# EAGLE design Loco-Universal (EAGLE 9.7.0)

## Sheet 1 of 2
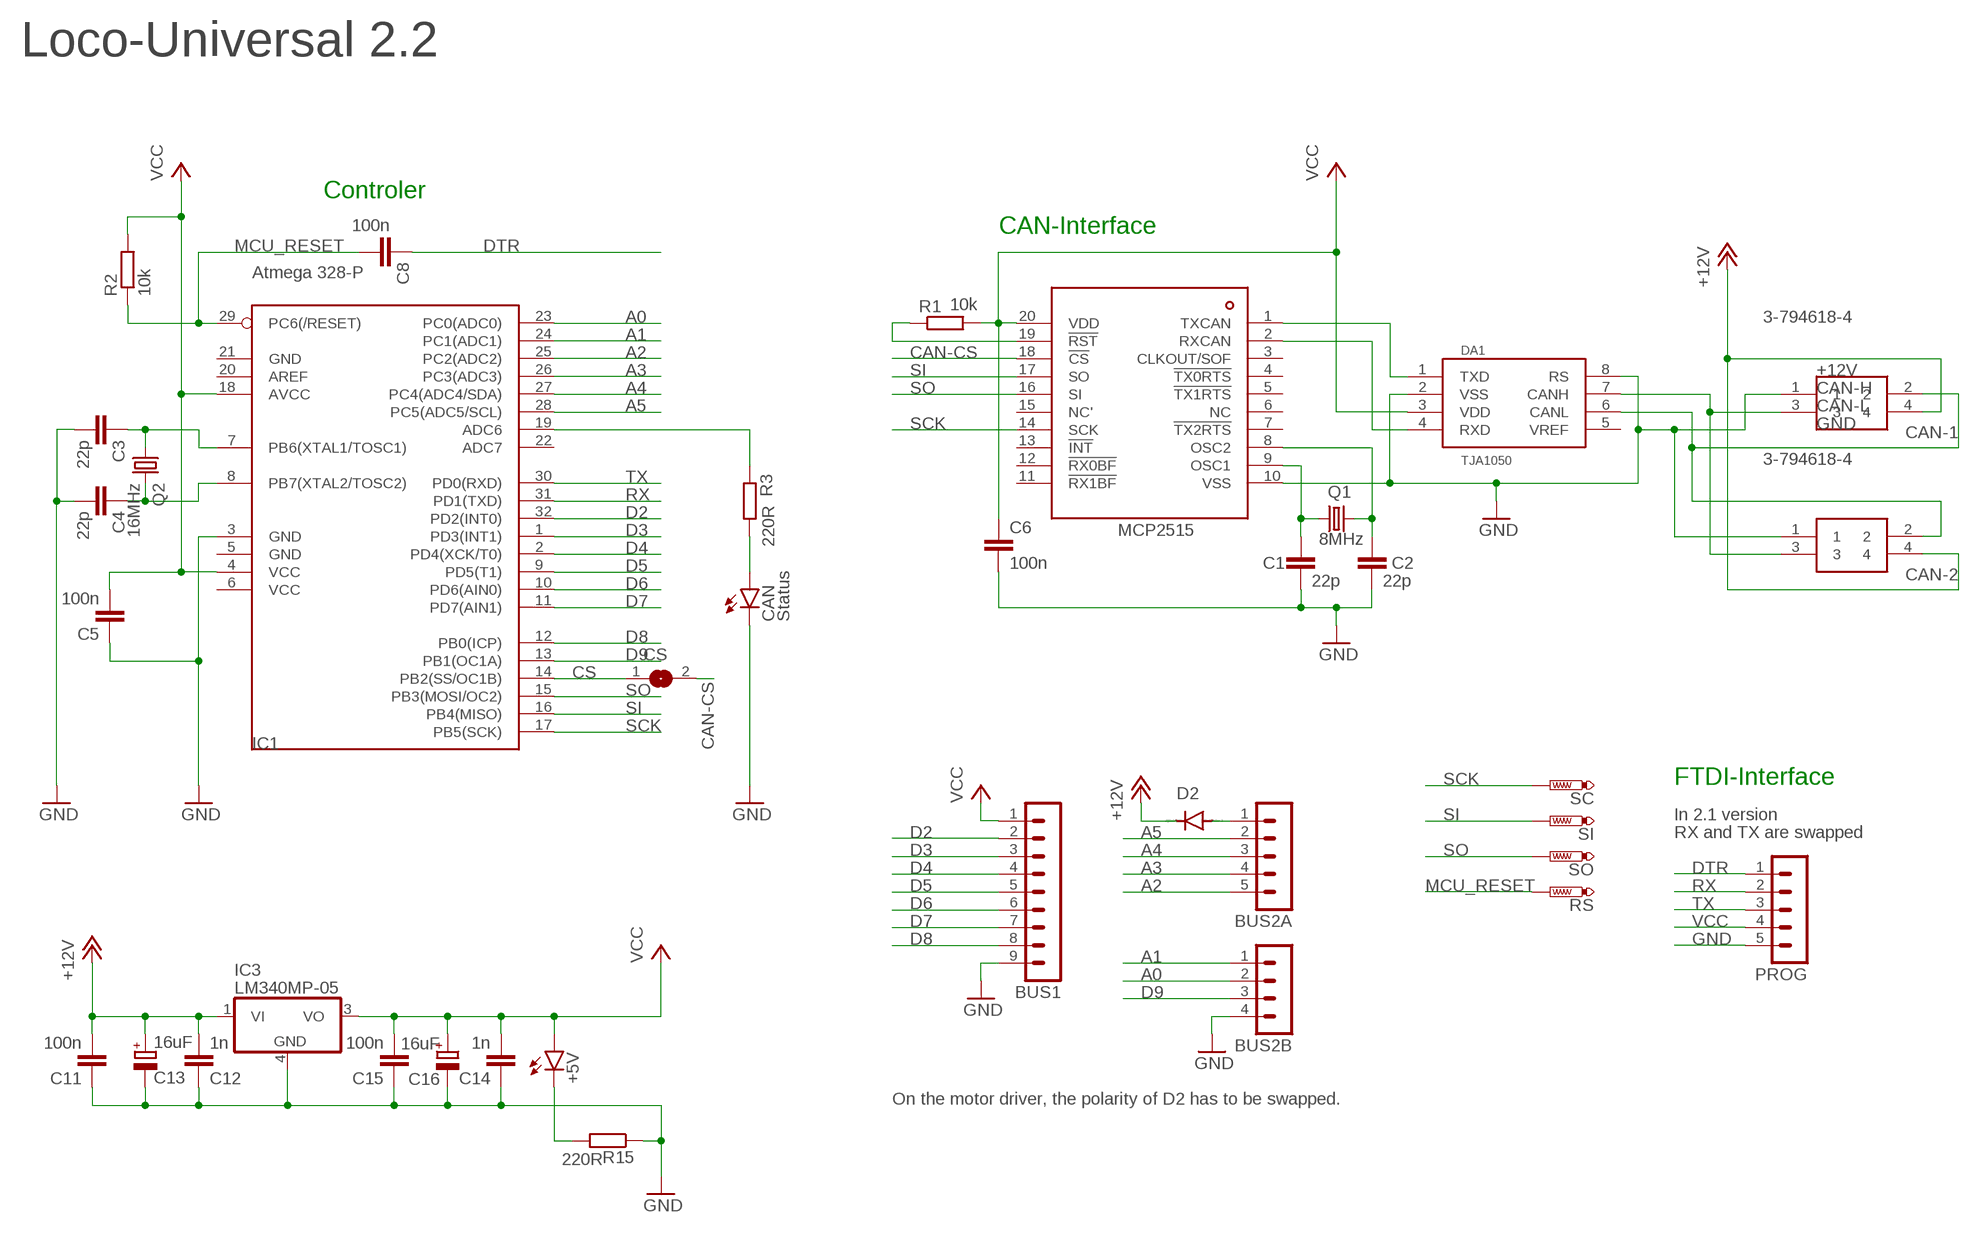
[diagram p0: schematic, sheet 1]

### Parts
+5V  LEDCHIP-LED0603  [CHIP-LED0603]
BUS1  MA09-1  [MA09-1]
BUS2A  MA05-1  [MA05-1]
BUS2B  MA04-1  [MA04-1]
C1  22p  C-EUC0402K  [C0402K]
C2  22p  C-EUC0402K  [C0402K]
C3  22p  C-EUC0402K  [C0402K]
C4  22p  C-EUC0402K  [C0402K]
C5  100n  C-EUC0402K  [C0402K]
C6  100n  C-EUC0402K  [C0402K]
C8  100n  C-EUC0402K  [C0402K]
C11  100n  C-EUC0402K  [C0402K]
C12  1n  C-EUC0402K  [C0402K]
C13  16uF  CPOL-EUA/3216-18W  [A/3216-18W]
C14  1n  C-EUC0402K  [C0402K]
C15  100n  C-EUC0402K  [C0402K]
C16  16uF  CPOL-EUA/3216-18W  [A/3216-18W]
CAN  Status  LEDCHIPLED_0603  [CHIPLED_0603]
CAN-1  3-794618-4  [SHDRRA4W102P300_2X2_686X892X73]
CAN-2  3-794618-4  [SHDRRA4W102P300_2X2_686X892X73]
CS  SJ  [SJ]
D2  DIODE-DO214AA  [DO214AA]
DA1  TJA1050  [SO08]
IC1  Atmega 328-P  MEGA8-AI  [TQFP32-08]
IC2  MCP2515  [TSSOP20]
IC3  LM340MP-05  [SOT223]
PROG  MA05-1  [MA05-1]
Q1  8MHz  CRYSTALHC49S  [HC49/S]
Q2  16MHz  CRYSTALHC49S  [HC49/S]
R1  10k  R-EU_MELF0102W  [MINI_MELF-0102W]
R2  10k  R-EU_MELF0102W  [MINI_MELF-0102W]
R3  220R  R-EU_MELF0102W  [MINI_MELF-0102W]
R15  220R  R-EU_MELF0102W  [MINI_MELF-0102W]
RS  PTR1B1,27  [B1,27]
SC  PTR1B1,27  [B1,27]
SI  PTR1B1,27  [B1,27]
SO  PTR1B1,27  [B1,27]

### Nets
+12V: C11.2 C12.2 C13.+ CAN-1.4 CAN-2.4 D2.C IC3.1(VI)
A0: BUS2B.2 IC1.23(PC0(ADC0))
A1: BUS2B.1 IC1.24(PC1(ADC1))
A2: BUS2A.5 IC1.25(PC2(ADC2))
A3: BUS2A.4 IC1.26(PC3(ADC3))
A4: BUS2A.3 IC1.27(PC4(ADC4/SDA))
A5: BUS2A.2 IC1.28(PC5(ADC5/SCL))
CAN-CS: CS.2 IC2.18(!CS)
CAN-H: CAN-1.3 CAN-2.3 DA1.7(CANH)
CAN-L: CAN-1.2 CAN-2.2 DA1.6(CANL)
CAN-OCC1: C1.1 IC2.9(OSC1) Q1.1
CAN-OCC2: C2.1 IC2.8(OSC2) Q1.2
CS: CS.1 IC1.14(PB2(SS/OC1B))
D2: BUS1.2 IC1.32(PD2(INT0))
D3: BUS1.3 IC1.1(PD3(INT1))
D4: BUS1.4 IC1.2(PD4(XCK/T0))
D5: BUS1.5 IC1.9(PD5(T1))
D6: BUS1.6 IC1.10(PD6(AIN0))
D7: BUS1.7 IC1.11(PD7(AIN1))
D8: BUS1.8 IC1.12(PB0(ICP))
D9: BUS2B.3 IC1.13(PB1(OC1A))
DTR: C8.1 PROG.1
GND: BUS1.9 BUS2B.4 C1.2 C2.2 C3.2 C4.2 C5.1 C6.2 C11.1 C12.1 C13.- C14.1 C15.1 C16.- CAN-1.1 CAN-2.1 CAN.C DA1.2(VSS) DA1.8(RS) IC1.3(GND) IC2.10(VSS) IC3.4(GND) PROG.5 R15.1
MCU_RESET: C8.2 IC1.29(PC6(/RESET)) R2.1 RS.TP
N$1: IC1.19(ADC6) R3.1
N$2: BUS2A.1 D2.A
N$3: CAN.A R3.2
N$6: IC2.19(!RST) R1.1
N$10: C3.1 IC1.7(PB6(XTAL1/TOSC1)) Q2.1
N$11: C4.1 IC1.8(PB7(XTAL2/TOSC2)) Q2.2
N$12: +5V.C R15.2
RX: IC1.31(PD1(TXD)) PROG.2
RXCAN: DA1.4(RXD) IC2.2(RXCAN)
SCK: IC1.17(PB5(SCK)) IC2.14(SCK) SC.TP
SI: IC1.16(PB4(MISO)) IC2.17(SO) SI.TP
SO: IC1.15(PB3(MOSI/OC2)) IC2.16(SI) SO.TP
TX: IC1.30(PD0(RXD)) PROG.3
TXCAN: DA1.1(TXD) IC2.1(TXCAN)
VCC: +5V.A BUS1.1 C5.2 C6.1 C14.2 C15.2 C16.+ DA1.3(VDD) IC1.4(VCC) IC1.18(AVCC) IC2.20(VDD) IC3.3(VO) PROG.4 R1.2 R2.2
Unconnected: DA1.5(VREF) IC1.20(AREF) IC1.22(ADC7) IC2.3(CLKOUT/SOF) IC2.4(!TX0RTS) IC2.5(!TX1RTS) IC2.6(NC) IC2.7(!TX2RTS) IC2.11(!RX1BF) IC2.12(!RX0BF) IC2.13(!INT) IC2.15(NC')

### Notes on the sheet
- Loco-Universal 2.2
- Controler
- CAN-Interface
- FTDI-Interface
- In 2.1 version
- RX and TX are swapped
- On the motor driver, the polarity of D2 has to be swapped.

## Sheet 2 of 2

## Power pins joined to a net without a drawn wire
GND: IC1.5(GND) IC1.21(GND)
VCC: IC1.6(VCC)

## Library data of the parts
+5V CAN = led:LED: LED OSRAM: - CHIPLED LG R971, LG N971, LY N971, LG Q971, LY Q971, LO R971, LY R971 LH N974, LH R974 LS Q976, LO Q976, LY Q976 LO Q996 - Hyper CHIPLED LW Q18S LB Q993, LB Q99A, LB R99A - SideLED LS A670, LO A670, LY A670, LG A670, LP A670 LB A673, LV A673, LT A673, LW A673 LH A674 LY A675 LS A676, LA A676, LO A676, LY A676, LW A676 LS A679, LY A679, LG A679 - Hyper Micro SIDELED® LS Y876, LA Y876, LO Y876, LY Y876 LT Y87S - SmartLED LW L88C, LW L88S LB L89C, LB L89S, LG L890 LS L89K, LO L89K, LY L89K LS L896, LA L896, LO L896, LY L896 - TOPLED LS T670, LO T670, LY T670, LG T670, LP T670 LSG T670, LSP T670, LSY T670, LOP T670, LYG T670 LG T671, LOG T671, LSG T671 LB T673, LV T673, LT T673, LW T673 LH T674 LS T676, LA T676, LO T676, LY T676, LB T676, LH T676, LSB T676, LW T676 LB T67C, LV T67C, LT T67C, LS T67K, LO T67K, LY T67K, LW E67C LS E67B, LA E67B, LO E67B, LY E67B, LB E67C, LV E67C, LT E67C LW T67C LS T679, LY T679, LG T679 LS T770, LO T770, LY T770, LG T770, LP T770 LB T773, LV T773, LT T773, LW T773 LH T774 LS E675, LA E675, LY E675, LS T675 LS T776, LA T776, LO T776, LY T776, LB T776 LHGB T686 LT T68C, LB T68C - Hyper Mini TOPLED® LB M676 - Mini TOPLED Santana® LG M470 LS M47K, LO M47K, LY M47K Source: http://www.osram.convergy.de LUXEON: - LUMILED® LXK2-PW12-R00, LXK2-PW12-S00, LXK2-PW14-U00, LXK2-PW14-V00 LXK2-PM12-R00, LXK2-PM12-S00, LXK2-PM14-U00 LXK2-PE12-Q00, LXK2-PE12-R00, LXK2-PE12-S00, LXK2-PE14-T00, LXK2-PE14-U00 LXK2-PB12-K00, LXK2-PB12-L00, LXK2-PB12-M00, LXK2-PB14-N00, LXK2-PB14-P00, LXK2-PB14-Q00 LXK2-PR12-L00, LXK2-PR12-M00, LXK2-PR14-Q00, LXK2-PR14-R00 LXK2-PD12-Q00, LXK2-PD12-R00, LXK2-PD12-S00 LXK2-PH12-R00, LXK2-PH12-S00 LXK2-PL12-P00, LXK2-PL12-Q00, LXK2-PL12-R00 Source: www.luxeon.com KINGBRIGHT: KA-3528ASYC Source: www.kingbright.com
BUS1 = con-lstb:MA09-1: PIN HEADER; OC_FARNELL: unknown; OC_NEWARK: unknown
BUS2A PROG = con-lstb:MA05-1: PIN HEADER; OC_FARNELL: unknown; OC_NEWARK: unknown
BUS2B = con-lstb:MA04-1: PIN HEADER; OC_FARNELL: unknown; OC_NEWARK: unknown
C1-C6 C8 C11 C12 C14 C15 = rcl:C-EU: CAPACITOR, European symbol; SPICEPREFIX: C
C13 C16 = rcl:CPOL-EU: POLARIZED CAPACITOR, European symbol; SPICEPREFIX: C
CAN-1 CAN-2 = SamacSys_Parts:3-794618-4: 4 way 2 row r/a header Mate-N-Lok Source: Datasheet <https://rs.componentsearchengine.com/Datasheets/2/3-794618-4.pdf>; DESCRIPTION: 4 way 2 row r/a header Mate-N-Lok; HEIGHT: 7.37mm; MANUFACTURER_NAME: TE Connectivity; MANUFACTURER_PART_NUMBER: 3-794618-4
CS = jumper:SJ: SMD solder JUMPER
D2 = diode:DIODE-: DIODE
DA1 = TJA1050:TJA1050: High speed CAN transceiver Input levels compatible with 3.3 V and 5 V devices 5V supply
IC1 = atmel:MEGA8: MICROCONTROLLER 8 Kbytes FLASH, 1 kbytes SRAM, 512 bytes EEPROM, USART, 6-channel 10 bit ADC, 2-channel 8 bit ADC Pin compatible with Atmega48, ATMega88, ATMega168 Source: avr.lbr; MPN: ATMEGA8-16AU; OC_FARNELL: 9171371; OC_NEWARK: 73M8863
IC2 = mcp2514:MCP2515: Microchip Technology’s MCP2515 is a stand-alone Controller Area Network (CAN) controller that implements the CAN specification, version 2.0B. It is capable of transmitting and receiving both standard and extended data and remote frames. The MCP2515 has two acceptance masks and six acceptance filters that are used to filter out unwanted messages, thereby reducing the host MCUs overhead. The MCP2515 interfaces with microcontrollers (MCUs) via an industry standard Serial Peripheral Interface (SPI).
IC3 = linear:LM340?-*: Positive VOLTAGE REGULATOR Source: http://cache.national.com/ds/LM/LM340.pdf
Q1 Q2 = crystal:CRYSTAL: CRYSTAL; OC_FARNELL: 1667008; OC_NEWARK: unknown
R1-R3 R15 = rcl:R-EU_: RESISTOR, European symbol; SPICEPREFIX: R
RS SC SI SO = testpad:PTR1: TEST PIN

## Board
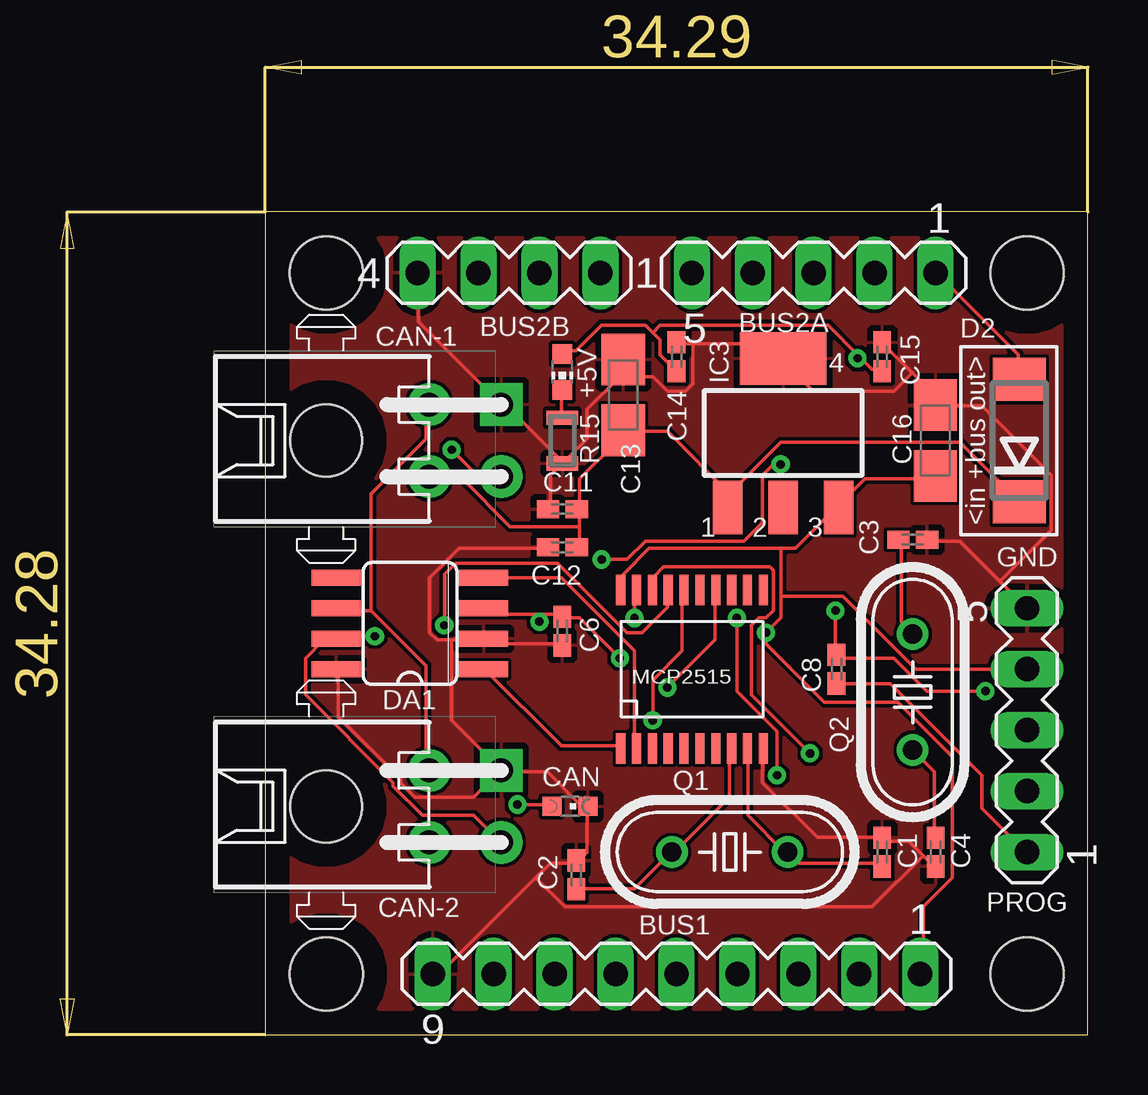
[diagram p1: board, top side]
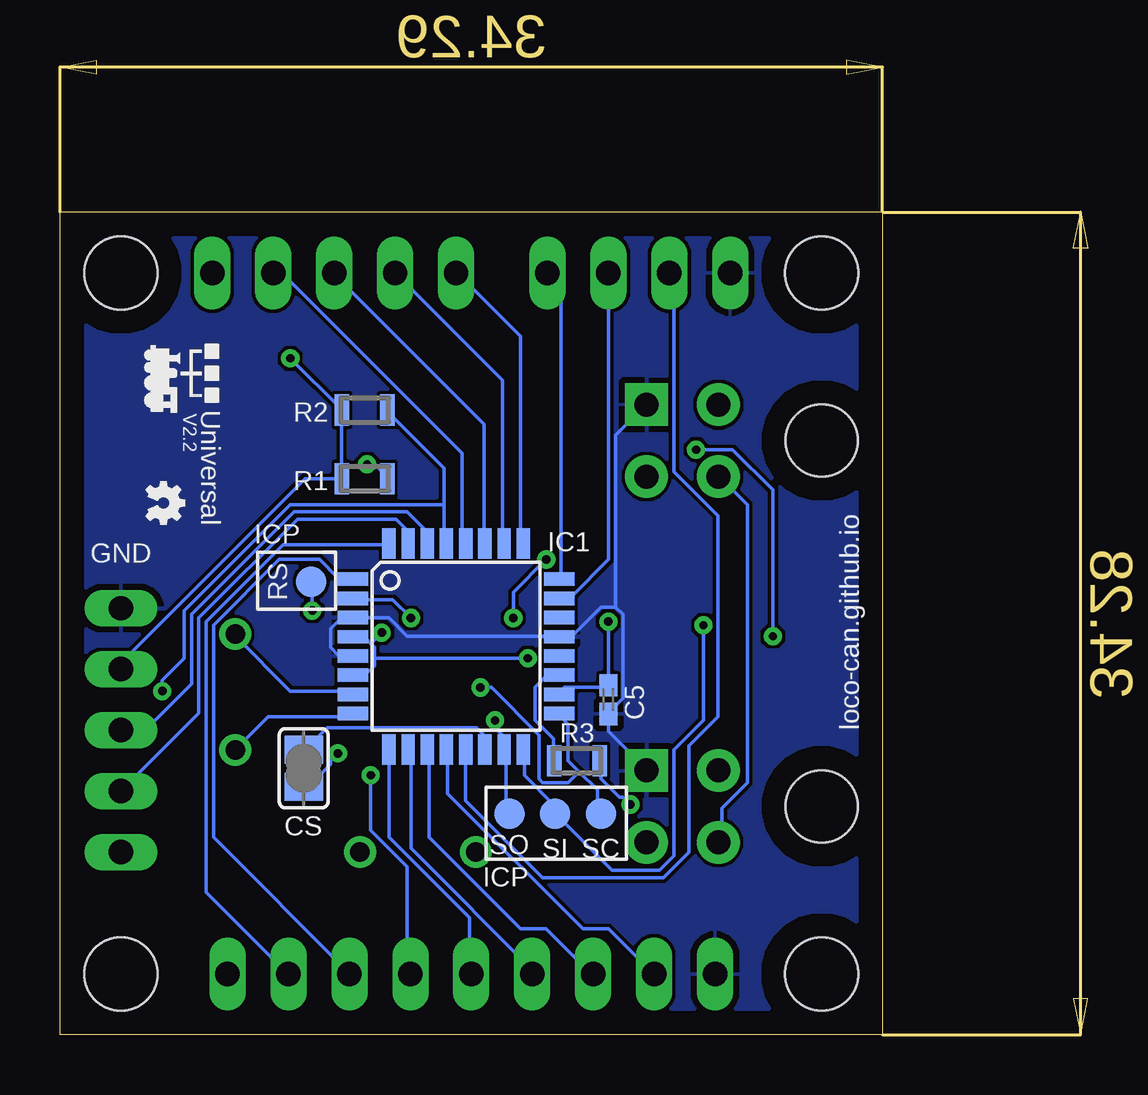
[diagram p2: board, bottom side, seen from below]

Size 34.29 x 34.29 mm. Coordinates in mm from the lower left corner, seen from the top.
Outline: 0,0 34.29,0 34.29,34.29 0,34.29 0,0
Copper layers (1*16): Top / Bottom
Stack-up Default Layer Stack: Top User Defined 0.035mm / Dielectric-1 User Defined 1.5mm / Bottom User Defined 0.035mm
Design rules "default": minimum track width 6mil, minimum drill 0.35mm, track to track 6mil, track to pad 6mil, pad to pad 6mil, via to via 6mil, smd to smd 6mil, copper to edge 40mil, drill to drill 6mil, minimum pad ring 10mil, minimum via ring 8mil, stop-mask expansion 4mil, vias tented up to drill 0mil, thermal gap 10mil
Holes 3.05 mm at 2.54,2.54 2.54,31.75 31.75,2.54 31.75,31.75

### Footprints (pad centres in the part's own frame; a part is rotated, then mirrored left to right if it is on the bottom)
CHIP-LED0603 = smd 0.8 x 0.8: A 0,-0.75; C 0,0.75
MA09-1 = drill 1.016 long: 1 -10.16,0; 2 -7.62,0; 3 -5.08,0; 4 -2.54,0; 5 0,0; 6 2.54,0; 7 5.08,0; 8 7.62,0; 9 10.16,0
MA05-1 = drill 1.016 long: 1 -5.08,0; 2 -2.54,0; 3 0,0; 4 2.54,0; 5 5.08,0
MA04-1 = drill 1.016 long: 1 -3.81,0; 2 -1.27,0; 3 1.27,0; 4 3.81,0
C0402K = smd 0.925 x 0.74: 1 -0.6,0; 2 0.6,0
A/3216-18W = smd 2.15 x 1.8: + 1.475,0; - -1.475,0
CHIPLED_0603 = smd 0.8 x 0.8: A 0,-0.75; C 0,0.75
SHDRRA4W102P300_2X2_686X892X73 = drill 1 pad 1.778 square: 1 1.5,-7.3 | drill 1 pad 1.778: 2 1.5,-4.3; 3 -1.5,-7.3; 4 -1.5,-4.3 | hole 3: 0,0
SJ = smd 1.168 x 1.6: 1 -0.762,0; 2 0.762,0
DO214AA = smd 1.8 x 2.2: A 2.55,0; C -2.55,0
SO08 = smd 0.66 x 2.032: 1 -1.905,-3.073; 2 -0.635,-3.073; 3 0.635,-3.073; 4 1.905,-3.073; 5 1.905,3.073; 6 0.635,3.073; 7 -0.635,3.073; 8 -1.905,3.073
TQFP32-08 = smd 1.27 x 0.559: 1 -4.293,2.8; 2 -4.293,2; 3 -4.293,1.2; 4 -4.293,0.4; 5 -4.293,-0.4; 6 -4.293,-1.2; 7 -4.293,-2; 8 -4.293,-2.8; 17 4.293,-2.8; 18 4.293,-2; 19 4.293,-1.2; 20 4.293,-0.4; 21 4.293,0.4; 22 4.293,1.2; 23 4.293,2; 24 4.293,2.8 | smd 0.559 x 1.27: 9 -2.8,-4.293; 10 -2,-4.293; 11 -1.2,-4.293; 12 -0.4,-4.293; 13 0.4,-4.293; 14 1.2,-4.293; 15 2,-4.293; 16 2.8,-4.293; 25 2.8,4.293; 26 2,4.293; 27 1.2,4.293; 28 0.4,4.293; 29 -0.4,4.293; 30 -1.2,4.293; 31 -2,4.293; 32 -2.8,4.293
TSSOP20 = smd 1.27 x 0.381: 1 -3.302,2.642; 2 -3.302,1.981; 3 -3.302,1.321; 4 -3.302,0.66; 5 -3.302,0; 6 -3.302,-0.66; 7 -3.302,-1.321; 8 -3.302,-1.981; 9 -3.302,-2.642; 10 -3.302,-3.302; 11 3.302,-3.302; 12 3.302,-2.642; 13 3.302,-1.981; 14 3.302,-1.321; 15 3.302,-0.66; 16 3.302,0; 17 3.302,0.66; 18 3.302,1.321; 19 3.302,1.981; 20 3.302,2.642
SOT223 = smd 1.219 x 2.235: 1 -2.311,-3.099; 2 0,-3.099; 3 2.311,-3.099 | smd 3.6 x 2.2: 4 0,3.099
HC49/S = drill 0.813: 1 -2.413,0; 2 2.413,0
MINI_MELF-0102W = smd 0.6 x 1.3: 1 -0.95,0; 2 0.95,0
B1,27 = smd 1.27 x 1.27: TP 0,0

### Placement (x,y rotation side)
+5V  12.38,27.62 180 top
BUS1  17.14,2.54 180 top
BUS2A  22.86,31.75 180 top
BUS2B  10.16,31.75 180 top
C1  25.72,7.62 90 top
C2  12.96,6.67 90 top
C3  26.99,20.64 0 top
C4  27.94,7.62 270 top
C5  11.43,13.97 90 bottom
C6  12.38,16.83 270 top
C8  23.81,15.24 90 top
C11  12.38,21.91 0 top
C12  12.38,20.32 0 top
C13  14.92,26.67 270 top
C14  17.14,28.26 270 top
C15  25.72,28.26 270 top
C16  27.94,24.77 270 top
CAN  12.7,9.53 270 top
CAN-1  2.54,24.77 90 top
CAN-2  2.54,9.53 90 top
CS  24.13,11.11 270 bottom
D2  31.43,24.77 90 top
DA1  6.03,17.14 90 top
IC1  17.78,16.19 0 bottom
IC2  17.46,15.24 90 top
IC3  21.59,25.08 0 top
PROG  31.75,12.7 90 top
Q1  19.37,7.62 180 top
Q2  26.99,14.29 270 top
R1  21.59,23.18 180 bottom
R2  21.59,26.04 180 bottom
R3  12.74,11.43 0 bottom
R15  12.38,24.77 90 top
RS  23.81,18.88 0 bottom
SC  11.75,9.21 0 bottom
SI  13.65,9.21 0 bottom
SO  15.56,9.21 0 bottom

### Tracks (layer width: path | path; a pad name or v marks a point on that pad's centre or on a via)
+12V
  Top 0.152: 13.11,21.18 13.11,21.79 C11.2 13.11,21.95 13.11,23.16 14.78,24.84 14.78,25.15 C13.+ 14.94,25.15 16.76,25.15 19.36,22.55 | 13.11,21.18 13.11,20.42 C12.2 | 19.36,22.55 21.49,24.69 28.96,24.69 31.39,22.25 D2.C | 19.36,22.55 19.36,22.1 IC3.1 19.36,22.55 | 13.11,21.18 10.21,21.18 8.23,23.16 6.86,23.16 CAN-1.4
  Bottom 0.152: CAN-2.4 6.71,8.08 6.71,9.45 5.64,10.52 5.64,22.1 6.71,23.16 CAN-1.4
A0
  Bottom 0.152: BUS2B.2 11.43,19.81 12.95,18.29 13.41,18.29 IC1.23
A1
  Bottom 0.152: IC1.24 13.41,19.05 13.41,31.24 13.87,31.7 BUS2B.1
A2
  Bottom 0.152: IC1.25 15.09,20.57 15.09,29.11 17.68,31.7 BUS2A.5
A3
  Bottom 0.152: BUS2A.4 15.85,27.28 15.85,20.57 IC1.26
A4
  Bottom 0.152: IC1.27 16.61,20.57 16.61,25.45 22.86,31.7 BUS2A.3
A5
  Bottom 0.152: IC1.28 17.53,20.57 17.53,24.23 24.99,31.7 25.3,31.7 BUS2A.2
CAN-CS  (via drill 0.35)
  Top 0.152: v22.71,11.73 20.27,14.17 20.27,17.07 20.57,17.37 20.88,17.37 21.18,17.68 21.18,19.36 21.03,19.51 16.61,19.51 16.15,19.05 16.15,18.59 IC2.18
  Bottom 0.152: v22.71,11.73 23.01,11.43 23.01,11.28 24.08,10.21 CS.2
CAN-H  (via drill 0.35)
  Top 0.152: CAN-2.3 9.75,8.08 8.69,9.14 6.55,9.14 5.33,10.36 5.33,10.52 1.68,14.17 1.68,15.7 2.44,16.46 2.9,16.46 DA1.7 3.05,16.61 v4.57,16.61 | v7.77,24.38 8.84,23.32 9.75,23.32 CAN-1.3
  Bottom 0.152: v7.77,24.38 6.25,24.38 4.57,22.71 v4.57,16.61
CAN-L
  Top 0.152: 4.42,17.68 3.05,17.68 DA1.6 | 4.42,17.68 6.71,15.39 6.71,11.12 CAN-2.2 | 4.42,17.68 4.42,22.55 6.71,24.84 6.71,26.21 CAN-1.2
CAN-OCC1
  Top 0.152: C1.1 25.6,7.16 22.25,7.16 21.79,7.62 Q1.1 21.64,7.62 20.12,9.14 20.12,11.89 IC2.9
CAN-OCC2
  Top 0.152: C2.1 13.11,6.1 15.39,6.1 16.92,7.62 Q1.2 17.07,7.62 19.36,9.91 19.36,11.89 IC2.8
CS
  Bottom 0.152: IC1.14 16.61,12.04 16.61,12.5 16.92,12.8 23.16,12.8 24.08,11.89 CS.1
D2
  Bottom 0.152: IC1.32 20.73,20.42 24.99,20.42 28.19,17.22 28.19,5.94 24.84,2.59 BUS1.2
D3
  Bottom 0.152: IC1.1 22.1,19.05 22.71,19.05 23.47,19.81 25.15,19.81 27.89,17.07 27.89,8.23 22.25,2.59 BUS1.3
D4  (via drill 0.35)
  Top 0.152: v19.66,17.37 19.66,14.33 21.34,12.65 v21.34,10.82
  Bottom 0.152: v19.66,17.37 20.42,18.14 21.95,18.14 IC1.2 | v21.34,10.82 21.34,8.53 19.81,7.01 19.81,2.59 BUS1.4
D5
  Bottom 0.152: IC1.9 20.57,11.89 20.57,8.23 17.22,4.88 17.22,2.59 BUS1.5
D6
  Bottom 0.152: IC1.10 19.66,11.89 19.66,7.77 14.48,2.59 BUS1.6
D7
  Bottom 0.152: IC1.11 18.9,11.89 18.9,8.23 15.09,4.42 14.02,4.42 12.19,2.59 BUS1.7
D8
  Bottom 0.152: IC1.12 18.14,11.89 18.14,10.06 12.5,4.42 11.43,4.42 9.6,2.59 BUS1.8
D9
  Bottom 0.152: BUS2B.3 8.69,31.55 8.69,23.47 6.86,21.64 6.86,13.26 8.08,12.04 8.08,7.62 9.14,6.55 14.17,6.55 17.37,9.75 17.37,11.89 IC1.13
DTR
  Top 0.152: C8.1 23.93,14.63 26.06,14.63 29.87,10.82 29.87,9.45 31.7,7.62 PROG.1
GND
  Top 0.152: 27.43,7.47 27.89,7.01 C4.2 | 27.43,7.47 26.82,8.08 25.76,8.08 C1.2 25.6,8.23 23.01,8.23 20.73,10.52 20.73,11.89 IC2.10 | 7.77,16.46 8.99,16.46 DA1.2 9.14,16.46 9.3,16.31 12.34,16.31 C6.2 | 7.77,16.46 7.16,16.46 6.86,16.76 6.86,19.05 8.08,20.27 11.73,20.27 C12.1 | CAN-2.1 9.91,10.97 11.76,10.97 13.13,9.6 13.41,9.6 CAN.C 13.41,9.45 13.41,7.62 13.11,7.32 C2.2 12.95,7.16 11.89,7.16 11.28,6.55 | DA1.8 3.05,15.24 3.05,13.26 5.64,10.67 5.64,10.52 6.25,9.91 8.69,9.91 9.75,10.97 CAN-2.1 | 11.28,6.55 7.32,2.59 7.01,2.59 BUS1.9 | 7.77,16.46 7.77,13.11 9.75,11.12 CAN-2.1 | 27.43,7.47 25.3,5.33 12.5,5.33 11.28,6.55 | C11.1 11.89,21.95 11.89,23.32 12.34,23.77 R15.1 | R15.1 12.34,23.93 9.91,26.36 CAN-1.1 9.75,26.36 6.4,29.72 6.4,31.7 BUS2B.4 | 14.78,27.43 14.78,28.04 C13.- 14.78,27.43 | 14.78,27.43 13.41,26.06 13.41,24.84 12.5,23.93 R15.1 | PROG.5 30.63,18.9 | 30.63,18.9 28.96,20.57 27.74,20.57 C3.2 | 26.98,27.58 27.89,26.67 27.89,26.36 C16.- 28.04,26.21 29.87,26.21 32.77,23.32 32.77,21.03 30.63,18.9 | 26.98,27.58 25.76,28.8 C15.1 | 17.83,28.8 20.88,28.8 21.49,28.19 IC3.4 21.64,28.04 22.86,26.82 26.21,26.82 26.98,27.58 | 17.83,28.8 17.22,28.8 C14.1 | 14.78,27.43 16.15,27.43 16.76,26.82 17.53,26.82 17.83,27.13 17.83,28.8
  Bottom 0.152: IC1.5 22.1,15.85 22.71,15.85 23.01,16.15 23.01,16.92 22.55,17.37 22.1,17.37 IC1.3 21.95,17.37 20.57,17.37 19.81,16.61 13.56,16.61 IC1.21 13.41,16.61 12.95,16.61 11.73,17.83 11.12,17.83 | CAN-2.1 9.91,11.12 11.43,12.65 C5.1 11.43,13.41 10.82,14.02 10.82,17.53 11.12,17.83 | 11.12,17.83 11.12,24.99 9.91,26.21 CAN-1.1
  pour Bottom: 0,34.29 34.29,34.29 34.29,0 0,0
  pour Top: 0,34.29 34.29,34.29 34.29,0 0,0
MCU_RESET  (via drill 0.35)
  Top 0.152: v23.77,17.68 23.77,15.85 C8.2 23.93,15.7 26.21,15.7 27.58,14.33 v30.02,14.33
  Bottom 0.152: v23.77,17.68 23.77,18.75 RS.TP | 18.29,22.1 18.29,23.62 20.57,25.91 R2.1 | 18.29,22.1 18.29,20.57 IC1.29 | v30.02,14.33 30.02,14.78 29.11,15.7 29.11,17.68 24.69,22.1 18.29,22.1
N$1
  Bottom 0.152: IC1.19 13.56,14.94 14.02,14.94 14.48,14.48 14.48,13.11 13.72,12.34 13.72,11.43 R3.1
N$2
  Top 0.152: D2.A 31.39,27.43 31.39,28.35 28.04,31.7 BUS2A.1
N$3  (via drill 0.35)
  Top 0.152: v10.52,9.6 11.89,9.6 CAN.A
  Bottom 0.152: v10.52,9.6 10.82,9.91 10.97,9.91 11.73,10.67 11.73,11.43 R3.2
N$6  (via drill 0.35)
  Top 0.152: v15.39,17.37 15.39,18.44 IC2.19 | v14.02,19.81 15.09,19.81 15.85,20.57 19.96,20.57 20.73,21.34 20.73,23.32 21.18,23.77 v21.49,23.77
  Bottom 0.152: v15.39,17.37 15.39,18.44 v14.02,19.81 | v21.49,23.77 21.18,23.77 20.73,23.32 R1.1
N$10
  Top 0.152: C3.1 26.52,20.57 26.52,17.22 26.98,16.76 Q2.1
  Bottom 0.152: IC1.7 22.1,14.33 24.69,14.33 26.98,16.61 Q2.1
N$11
  Top 0.152: Q2.2 27.89,10.97 27.89,8.23 C4.1
  Bottom 0.152: Q2.2 25.6,13.26 22.1,13.26 IC1.8
N$12
  Top 0.152: +5V.C 12.34,26.82 12.34,25.76 R15.2
RX
  Bottom 0.152: PROG.2 28.5,13.41 28.5,17.37 24.38,21.49 20.27,21.49 19.81,21.03 19.81,20.57 IC1.31
RXCAN
  Top 0.152: DA1.4 12.34,19.05 15.39,16 15.39,12.04 IC2.2
SCK  (via drill 0.35)
  Top 0.152: v16.76,14.48 18.75,16.46 18.75,18.44 IC2.14
  Bottom 0.152: 12.65,10.97 13.11,11.43 13.11,12.95 13.41,13.26 IC1.17 | 12.65,10.97 11.89,10.21 11.89,9.3 SC.TP | v16.76,14.48 16.31,14.48 14.33,12.5 14.33,10.67 14.17,10.52 13.11,10.52 12.65,10.97
SI  (via drill 0.35)
  Top 0.152: v7.47,17.07 7.47,19.2 7.92,19.66 12.19,19.66 15.09,16.76 15.7,16.76 16.76,17.83 16.76,18.44 IC2.17
  Bottom 0.152: IC1.16 14.94,11.89 14.94,10.82 13.72,9.6 13.72,9.3 SI.TP 13.56,9.14 11.28,6.86 9.3,6.86 8.69,7.47 8.69,11.89 7.47,13.11 v7.47,17.07
SO  (via drill 0.35)
  Top 0.152: v16.15,13.11 16.15,14.78 17.37,16 17.37,18.44 IC2.16
  Bottom 0.152: SO.TP 15.7,9.3 15.7,11.89 IC1.15 15.85,12.04 15.85,12.5 16.15,12.8 v16.15,13.11
TX
  Bottom 0.152: IC1.30 19.05,20.57 19.05,21.03 19.81,21.79 24.54,21.79 28.8,17.53 28.8,14.63 30.63,12.8 31.7,12.8 PROG.3
TXCAN
  Top 0.152: IC2.1 14.78,12.04 12.34,12.04 9.14,15.24 DA1.1
VCC  (via drill 0.35)
  Top 0.152: 16.15,29.26 16.46,28.96 16.46,28.35 17.07,27.74 C14.2 | 16.15,29.26 15.85,29.57 14.02,29.57 12.95,28.5 12.5,28.5 +5V.A | 24.69,28.35 23.47,29.57 16.46,29.57 16.15,29.26 | 24.69,28.35 25.3,27.74 25.6,27.74 C15.2 | v24.69,28.19 24.69,28.35 | 11.43,17.53 9.3,17.53 9.14,17.68 DA1.3 | 11.43,17.53 12.34,17.53 C6.1 12.5,17.37 13.11,17.37 v14.78,15.7 | 11.43,17.53 v11.43,17.22 | 21.49,20.27 22.1,20.27 23.77,21.95 IC3.3 23.93,22.1 24.99,23.16 27.89,23.16 C16.+ | 21.49,20.27 16,20.27 14.94,19.2 14.94,18.59 IC2.20 | 21.49,20.27 21.49,18.29 | 21.49,18.29 21.49,17.37 v20.88,16.76 20.88,16.31 23.32,13.87 26.36,13.87 28.65,11.58 28.65,6.55 27.43,5.33 27.43,2.59 BUS1.1 | PROG.4 27.13,15.24 24.08,18.29 21.49,18.29
  Bottom 0.152: PROG.4 31.7,15.24 31.7,15.54 24.08,23.16 22.55,23.16 R1.2 22.55,23.32 22.55,25.91 R2.2 22.55,26.06 v24.69,28.19 | IC1.18 13.41,14.33 13.26,14.48 11.43,14.48 C5.2 v11.43,17.22 | 21.18,15.7 21.18,16.15 21.34,16.31 | 21.18,15.7 21.18,15.39 21.49,15.09 21.95,15.09 IC1.6 | 21.34,16.31 21.49,16.46 21.95,16.46 IC1.4 | 21.34,16.31 v20.88,16.76 | 21.18,15.7 v14.78,15.7

### Text on the board
tNames: <in +bus out> | GND
bNames: V2.2 | Universal | ICP | GND | loco-can.github.io | ICP